# Altium schematic sheet AUDIO_CODEC_CS4270-B.SchDoc: Audio CODEC
size A4; DocumentNumber: 2; Revision: 1; SheetNumber: 3; SheetTotal: 12; Organization: Altium Limited.; Address1: Level 3, 12a Rodborough Rd; Address2: Frenchs Forest 2086; Address3: NSW; Address4: AUSTRALIA
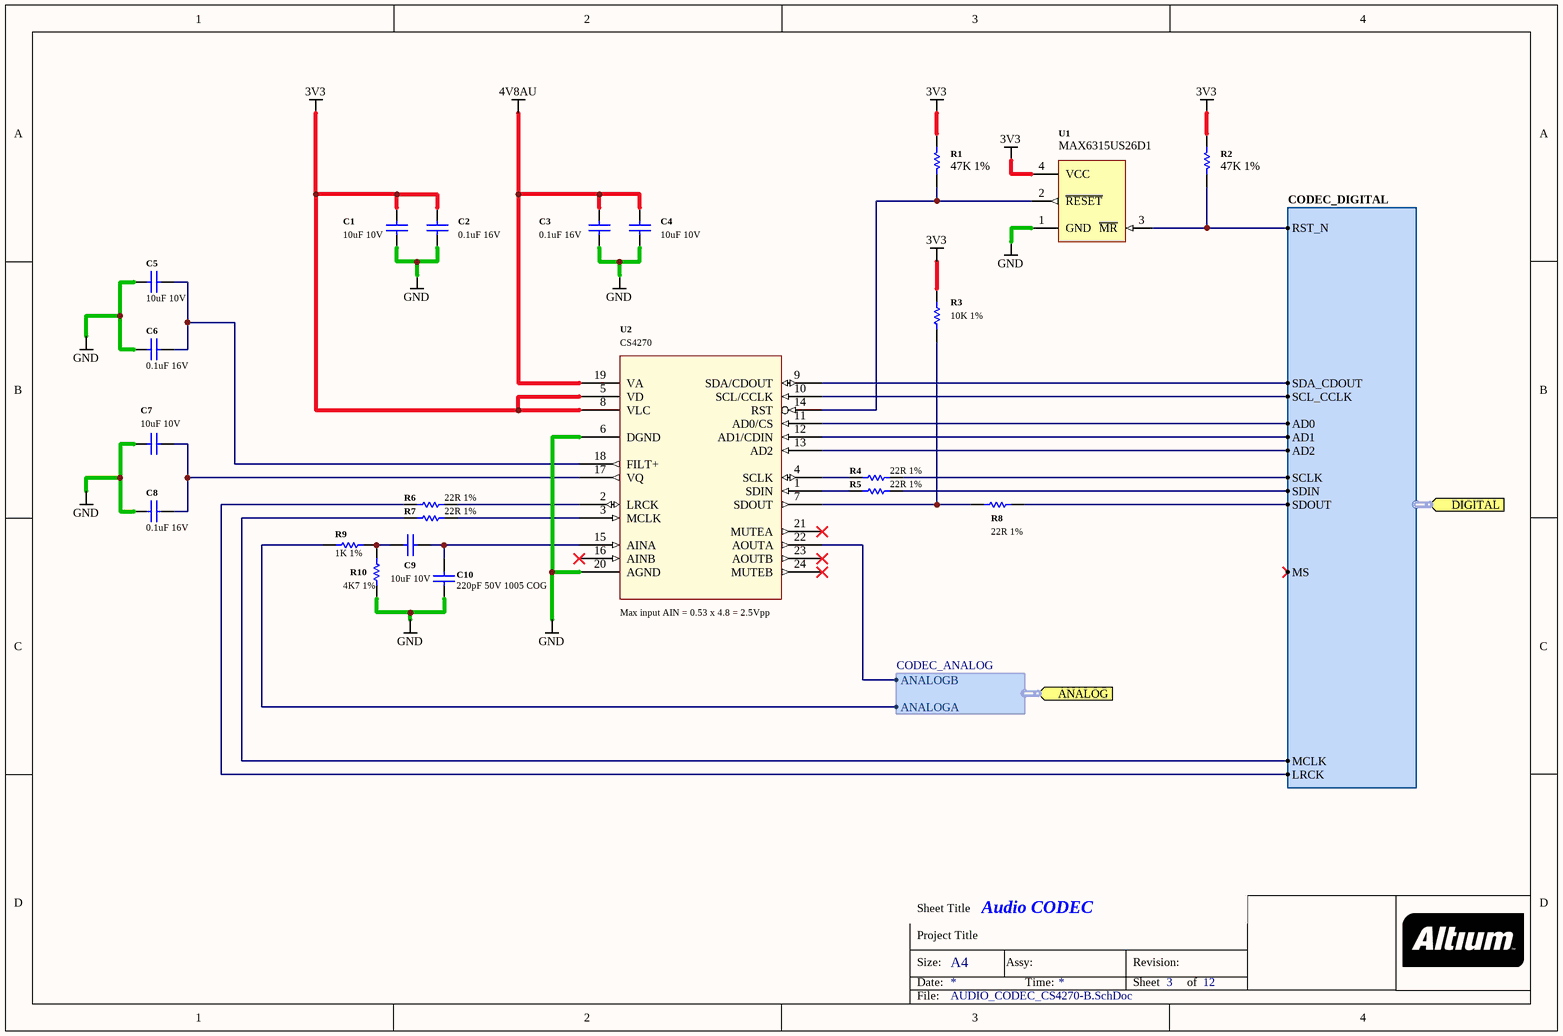
[diagram p0: AUDIO_CODEC_CS4270-B.SchDoc]

## Parts
C1  10uF 10V  [CAPC2012-STAR]
C2  0.1uF 16V  [CAPC1005-STAR]
C3  0.1uF 16V  [CAPC1005-STAR]
C4  10uF 10V  [CAPC2012-STAR]
C5  10uF 10V  [CAPC2012-STAR]
C6  0.1uF 16V  [CAPC1005-STAR]
C7  10uF 10V  [CAPC2012-STAR]
C8  0.1uF 16V  [CAPC1005-STAR]
C9  10uF 10V  [CAPC2012-STAR]
C10  220pF 50V 1005 COG  [CAPC1005-STAR]
R1  47K 1%  [RESC1005-STAR]
R2  47K 1%  [RESC1005-STAR]
R3  10K 1%  [RESC1005-STAR]
R4  22R 1%  [RESC1005-STAR]
R5  22R 1%  [RESC1005-STAR]
R6  22R 1%  [RESC1005-STAR]
R7  22R 1%  [RESC1005-STAR]
R8  22R 1%  [RESC1005-STAR]
R9  1K 1%  [RESC1005-STAR]
R10  4K7 1%  [RESC1005-STAR]
U1  MAX6315US26D1  [SOT143]
U2  CS4270  [TSSOP-24]

## Ports
ANALOG (harness CODEC_ANALOG), DIGITAL (harness CODEC_DIGITAL)

## Harnesses
CODEC_DIGITAL: SDA_CDOUT, SCL_CCLK, RST_N, AD0, AD1, SDOUT, AD2, SDIN, MS, MCLK, LRCK, SCLK
CODEC_ANALOG: ANALOGA, ANALOGB

## Nets
3V3: C1.1 C2.1 R1.2 R2.2 R3.1 U1.4(VCC) U2.5(VD) U2.8(VLC)
4V8AU: C3.1 C4.1 U2.19(VA)
GND: C1.2 C2.2 C3.2 C4.2 C5.2 C6.1 C7.2 C8.2 C10.2 R10.1 U1.1(GND) U2.6(DGND) U2.20(AGND)
NetC5_1: C5.1 C6.2 U2.18(FILT+)
NetC7_1: C7.1 C8.1 U2.17(VQ)
NetC9_1: C9.1 C10.1 U2.15(AINA)
NetC9_2: C9.2 R9.2 R10.2
NetR1_1: R1.1 U1.2(~{RESET}) U2.14(RST)
NetR2_1: R2.1 U1.3(~{MR}) ; port DIGITAL.RST_N
NetR3_2: R3.2 R8.1 U2.7(SDOUT)
NetR4_1: R4.1 U2.4(SCLK)
NetR4_2: R4.2 ; port DIGITAL.SCLK
NetR5_1: R5.1 U2.1(SDIN)
NetR5_2: R5.2 ; port DIGITAL.SDIN
NetR6_1: R6.1 ; port DIGITAL.LRCK
NetR6_2: R6.2 U2.2(LRCK)
NetR7_1: R7.1 ; port DIGITAL.MCLK
NetR7_2: R7.2 U2.3(MCLK)
NetR8_2: R8.2 ; port DIGITAL.SDOUT
NetR9_1: R9.1 ; port ANALOG.ANALOGA
NetU2_9: U2.9(SDA/CDOUT) ; port DIGITAL.SDA_CDOUT
NetU2_10: U2.10(SCL/CCLK) ; port DIGITAL.SCL_CCLK
NetU2_11: U2.11(AD0/CS) ; port DIGITAL.AD0
NetU2_12: U2.12(AD1/CDIN) ; port DIGITAL.AD1
NetU2_13: U2.13(AD2) ; port DIGITAL.AD2
NetU2_22: U2.22(AOUTA) ; port ANALOG.ANALOGB

Not connected (* = marked no-connect by the designer): U2 16(AINB)* 21(MUTEA)* 23(AOUTB)* 24(MUTEB)*

## Notes on the sheet
- (near U2) Max input AIN = 0.53 x 4.8 = 2.5Vpp
- Sheet Title
- Project Title
- Size:
- Date:
- A4
- Assy:
- Time:
- Revision:
- Sheet
- of
- File:

## Library data of the parts
C1 C4 C5 C7 C9 = D-101-0087: Capacitor, Ceramic, 10uF 10% 10V 0805 (2012) X5R; Polarity: Non-Polarized; Capacitance: 10 uF; Dielectric: X5R; Mounting Technology: Surface Mount; Rated Voltage: 10 V; Status: Unreleased; Technology: None; Tolerance: 10 %; Category: Capacitor
C2 C3 C6 C8 = D-101-0080: Capacitor, Ceramic, 0.1uF 10% 16V 0402 (1005) X7R; Polarity: Non-Polarized; Capacitance: 0.1 uF; Dielectric: X7R; Mounting Technology: Surface Mount; Rated Voltage: 16 V; Status: Production; Technology: Ceramic; Tolerance: 10 %; Category: Capacitor
C10 = D-101-0064: Capacitor, Ceramic, 220pF 5% 50V 0402 (1005) COG; Polarity: Non-Polarized; Capacitance: 220 pF; Dielectric: COG; Mounting Technology: Surface Mount; Rated Voltage: 50 V; Status: Unreleased; Technology: Ceramic; Tolerance: 5 %; Category: Capacitor
R1 R2 = D-100-0092: Resistor, 47K 1% 0402 (1005); Power Rating: 63 mW; Mounting Technology: Surface Mount; Resistance: 47 K; Status: Production; Tolerance: 1 %; Category: Resistor
R3 = D-100-0130: Resistor, 10K 1% 0402 (1005); Power Rating: 63 mW; Mounting Technology: Surface Mount; Resistance: 10 K; Status: Production; Tolerance: 1 %; Category: Resistor
R4-R8 = D-100-0113: Resistor, 22R 1% 0402 (1005); Power Rating: 63 mW; Mounting Technology: Surface Mount; Resistance: 22 R; Status: Production; Tolerance: 1 %; Category: Resistor
R9 = D-100-0121: Resistor, 1K 1% 0402 (1005); Power Rating: 63 mW; Mounting Technology: Surface Mount; Resistance: 1 K; Status: Production; Tolerance: 1 %; Category: Resistor
R10 = D-100-0088: Resistor, 4K7 1% 0402 (1005); Power Rating: 63 mW; Resistance: 4.7 K; Mounting Technology: Surface Mount; Status: Production; Tolerance: 1 %; Category: Resistor
U1 = D-243-0000: MAX6315, Open-Drain Output SOT Reset IC, Customized Reset Thresholds, Timeout Delays; Status: Production; Category: IC-Other
U2 = D-201-0003: CS4270; 24-Bit, 192 kHz Stereo Audio CODEC; AudioICTypes: Amplifier; Supply Voltage: mV; Mounting Technology: Surface Mount; Status: Unreleased; Category: IC-Audio